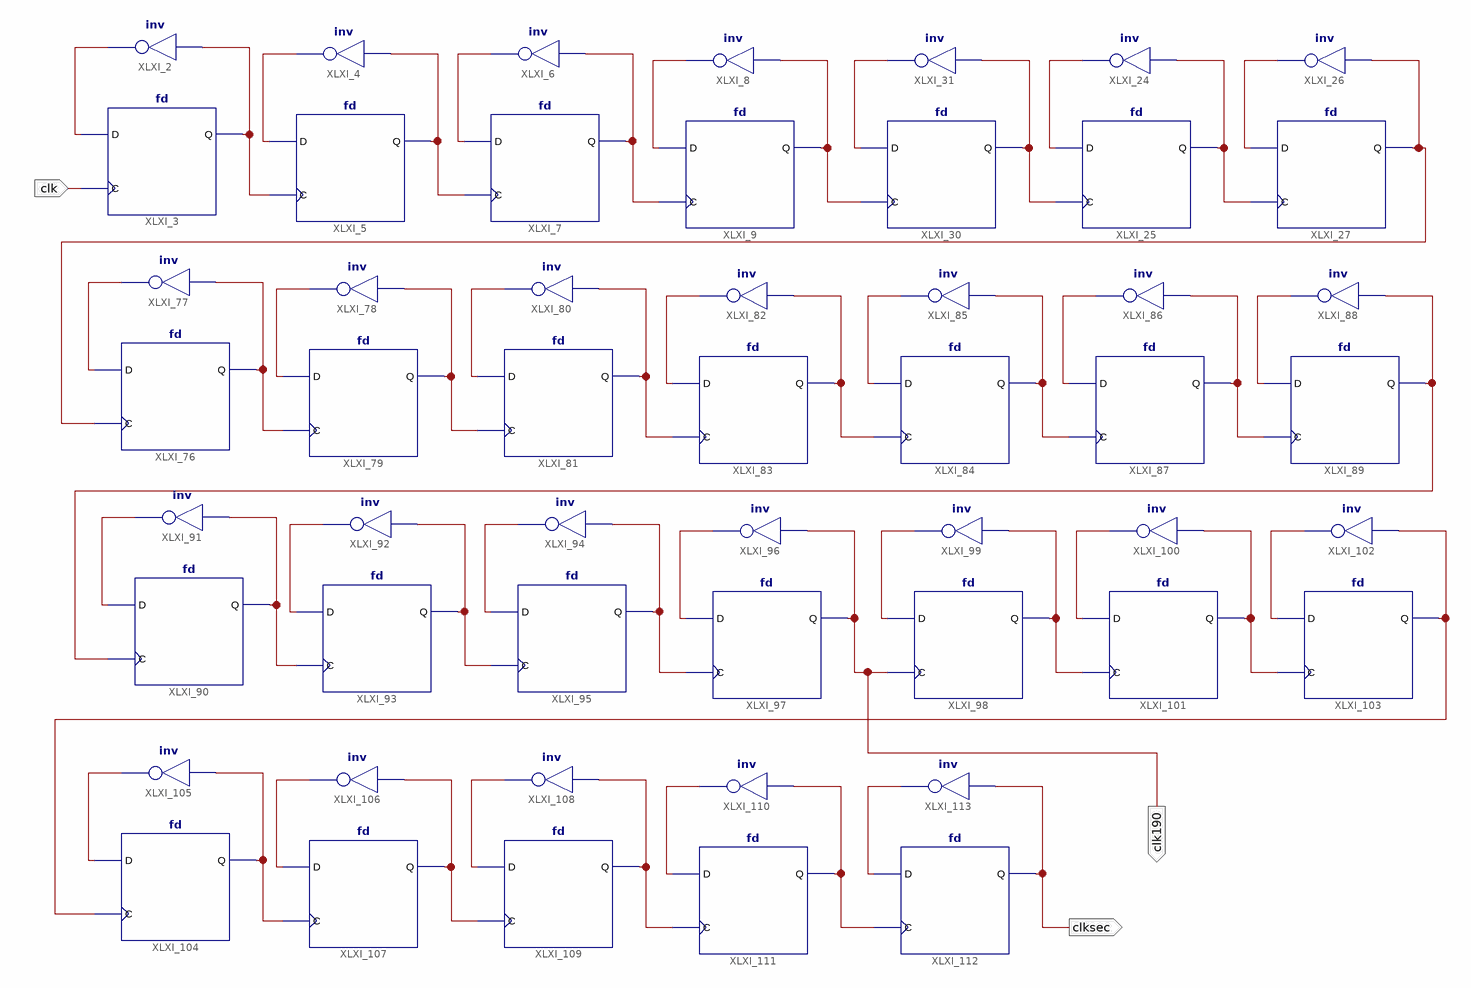
[diagram p0: schematic sheet 1]
// Xilinx ISE schematic clkdiv.sch (spartan3e) as structural Verilog: 52 symbols, 3 ports
module clkdiv (
  input  clk,
  output clk190,
  output clksec
);

  wire XLXN_4, XLXN_5, XLXN_6, XLXN_7, XLXN_9, XLXN_10, XLXN_11, XLXN_12, XLXN_28, XLXN_29, XLXN_30, XLXN_34,
       XLXN_35, XLXN_84, XLXN_85, XLXN_86, XLXN_87, XLXN_88, XLXN_89, XLXN_90, XLXN_91, XLXN_92, XLXN_93,
       XLXN_94, XLXN_95, XLXN_96, XLXN_97, XLXN_98, XLXN_99, XLXN_100, XLXN_101, XLXN_102, XLXN_103,
       XLXN_104, XLXN_105, XLXN_107, XLXN_108, XLXN_109, XLXN_110, XLXN_111, XLXN_116, XLXN_117, XLXN_118,
       XLXN_119, XLXN_120, XLXN_121, XLXN_122, XLXN_123, XLXN_125, XLXN_130;

  fd XLXI_3 (.C(clk), .D(XLXN_4), .Q(XLXN_5));
  not XLXI_2 (XLXN_4, XLXN_5);
  not XLXI_4 (XLXN_6, XLXN_7);
  fd XLXI_5 (.C(XLXN_5), .D(XLXN_6), .Q(XLXN_7));
  not XLXI_6 (XLXN_9, XLXN_10);
  fd XLXI_7 (.C(XLXN_7), .D(XLXN_9), .Q(XLXN_10));
  not XLXI_8 (XLXN_11, XLXN_12);
  fd XLXI_9 (.C(XLXN_10), .D(XLXN_11), .Q(XLXN_12));
  fd XLXI_30 (.C(XLXN_12), .D(XLXN_35), .Q(XLXN_34));
  not XLXI_31 (XLXN_35, XLXN_34);
  not XLXI_24 (XLXN_28, XLXN_29);
  fd XLXI_25 (.C(XLXN_34), .D(XLXN_28), .Q(XLXN_29));
  not XLXI_26 (XLXN_30, XLXN_84);
  fd XLXI_27 (.C(XLXN_29), .D(XLXN_30), .Q(XLXN_84));
  fd XLXI_76 (.C(XLXN_84), .D(XLXN_86), .Q(XLXN_85));
  not XLXI_77 (XLXN_86, XLXN_85);
  not XLXI_78 (XLXN_87, XLXN_88);
  fd XLXI_79 (.C(XLXN_85), .D(XLXN_87), .Q(XLXN_88));
  not XLXI_80 (XLXN_89, XLXN_90);
  fd XLXI_81 (.C(XLXN_88), .D(XLXN_89), .Q(XLXN_90));
  not XLXI_82 (XLXN_91, XLXN_92);
  fd XLXI_83 (.C(XLXN_90), .D(XLXN_91), .Q(XLXN_92));
  fd XLXI_84 (.C(XLXN_92), .D(XLXN_94), .Q(XLXN_93));
  not XLXI_85 (XLXN_94, XLXN_93);
  not XLXI_86 (XLXN_95, XLXN_96);
  fd XLXI_87 (.C(XLXN_93), .D(XLXN_95), .Q(XLXN_96));
  not XLXI_88 (XLXN_97, XLXN_98);
  fd XLXI_89 (.C(XLXN_96), .D(XLXN_97), .Q(XLXN_98));
  fd XLXI_90 (.C(XLXN_98), .D(XLXN_100), .Q(XLXN_99));
  not XLXI_91 (XLXN_100, XLXN_99);
  not XLXI_92 (XLXN_101, XLXN_102);
  fd XLXI_93 (.C(XLXN_99), .D(XLXN_101), .Q(XLXN_102));
  not XLXI_94 (XLXN_103, XLXN_104);
  fd XLXI_95 (.C(XLXN_102), .D(XLXN_103), .Q(XLXN_104));
  not XLXI_96 (XLXN_105, clk190);
  fd XLXI_97 (.C(XLXN_104), .D(XLXN_105), .Q(clk190));
  fd XLXI_98 (.C(clk190), .D(XLXN_108), .Q(XLXN_107));
  not XLXI_99 (XLXN_108, XLXN_107);
  not XLXI_102 (XLXN_111, XLXN_130);
  not XLXI_100 (XLXN_109, XLXN_110);
  fd XLXI_103 (.C(XLXN_110), .D(XLXN_111), .Q(XLXN_130));
  fd XLXI_101 (.C(XLXN_107), .D(XLXN_109), .Q(XLXN_110));
  fd XLXI_104 (.C(XLXN_130), .D(XLXN_117), .Q(XLXN_116));
  not XLXI_105 (XLXN_117, XLXN_116);
  not XLXI_106 (XLXN_118, XLXN_119);
  fd XLXI_107 (.C(XLXN_116), .D(XLXN_118), .Q(XLXN_119));
  not XLXI_108 (XLXN_120, XLXN_121);
  fd XLXI_109 (.C(XLXN_119), .D(XLXN_120), .Q(XLXN_121));
  not XLXI_110 (XLXN_122, XLXN_123);
  fd XLXI_111 (.C(XLXN_121), .D(XLXN_122), .Q(XLXN_123));
  fd XLXI_112 (.C(XLXN_123), .D(XLXN_125), .Q(clksec));
  not XLXI_113 (XLXN_125, clksec);
endmodule
